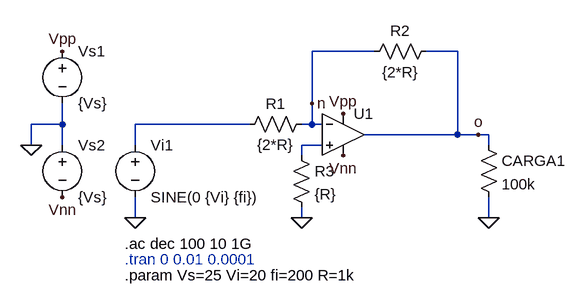
[diagram p0: schematic ex3a.asc]
ex3a.asc, the LTspice schematic file:
Version 4
SHEET 1 880 680
WIRE 304 0 208 0
WIRE 432 0 384 0
WIRE 208 80 208 0
WIRE -176 112 -176 80
WIRE -176 112 -224 112
WIRE 112 112 -64 112
WIRE 208 112 208 80
WIRE 208 112 192 112
WIRE 224 112 208 112
WIRE 432 128 432 0
WIRE 432 128 288 128
WIRE 464 128 432 128
WIRE 480 128 464 128
WIRE -224 144 -224 112
WIRE -176 144 -176 112
WIRE -64 144 -64 112
WIRE 224 144 192 144
WIRE 480 144 480 128
WIRE 192 160 192 144
WIRE -64 256 -64 224
WIRE 192 256 192 240
WIRE 480 256 480 224
FLAG -64 256 0
FLAG 480 256 0
FLAG -224 144 0
FLAG -176 0 Vpp
FLAG -176 224 Vnn
FLAG 464 128 o
FLAG 256 96 Vpp
FLAG 256 160 Vnn
FLAG 208 80 n
FLAG 192 256 0
SYMBOL voltage -64 128 R0
SYMATTR InstName Vi1
SYMATTR Value SINE(0 {Vi} {fi})
SYMBOL res 208 96 R90
WINDOW 0 0 56 VBottom 2
WINDOW 3 32 56 VTop 2
SYMATTR InstName R1
SYMATTR Value {2*R}
SYMBOL res 400 -16 R90
WINDOW 0 0 56 VBottom 2
WINDOW 3 32 56 VTop 2
SYMATTR InstName R2
SYMATTR Value {2*R}
SYMBOL OpAmps\\UniversalOpAmp2 256 128 R0
SYMATTR InstName U1
SYMATTR Value2 Avol=125 GBW=10Meg Slew=10Meg
SYMBOL voltage -176 -16 R0
SYMATTR InstName Vs1
SYMATTR Value {Vs}
SYMBOL voltage -176 128 R0
SYMATTR InstName Vs2
SYMATTR Value {Vs}
SYMBOL res 464 128 R0
SYMATTR InstName CARGA1
SYMATTR Value 100k
SYMBOL res 176 144 R0
SYMATTR InstName R3
SYMATTR Value {R}
TEXT -80 344 Left 2 !.param Vs=25 Vi=20 fi=200 R=1k
TEXT -80 320 Left 2 ;.tran 0 0.01 0.0001
TEXT -80 296 Left 2 !.ac dec 100 10 1G

The netlist it stands for:
* ex3a.asc
Vi1 N001 0 SINE(0 {Vi} {fi})
R1 n N001 {2*R}
R2 o n {2*R}
XU1 N002 n Vpp Vnn o level2 Avol=125 GBW=10Meg Slew=10Meg Ilimit=25m Rail=0 Vos=0 En=0 Enk=0 In=0 Ink=0 Rin=500Meg  ; pins In+ In- V+ V- OUT
Vs1 Vpp 0 {Vs}
Vs2 0 Vnn {Vs}
R§CARGA1 o 0 100k
R3 N002 0 {R}
.param Vs=25 Vi=20 fi=200 R=1k
* .tran 0 0.01 0.0001
.ac dec 100 10 1G
.lib UniversalOpAmp2.lib
.backanno
.end

* Results of the author's LTspice run, read from the files saved beside the schematic
* Operating Point, zero values left out:
*   V(vpp) = 25 V
*   V(vnn) = -25 V
*   I(Vs1) = -2.492 mA
*   I(Vs2) = -2.492 mA
*   Ix(u1:3) = 2.492 mA
*   Ix(u1:4) = -2.492 mA